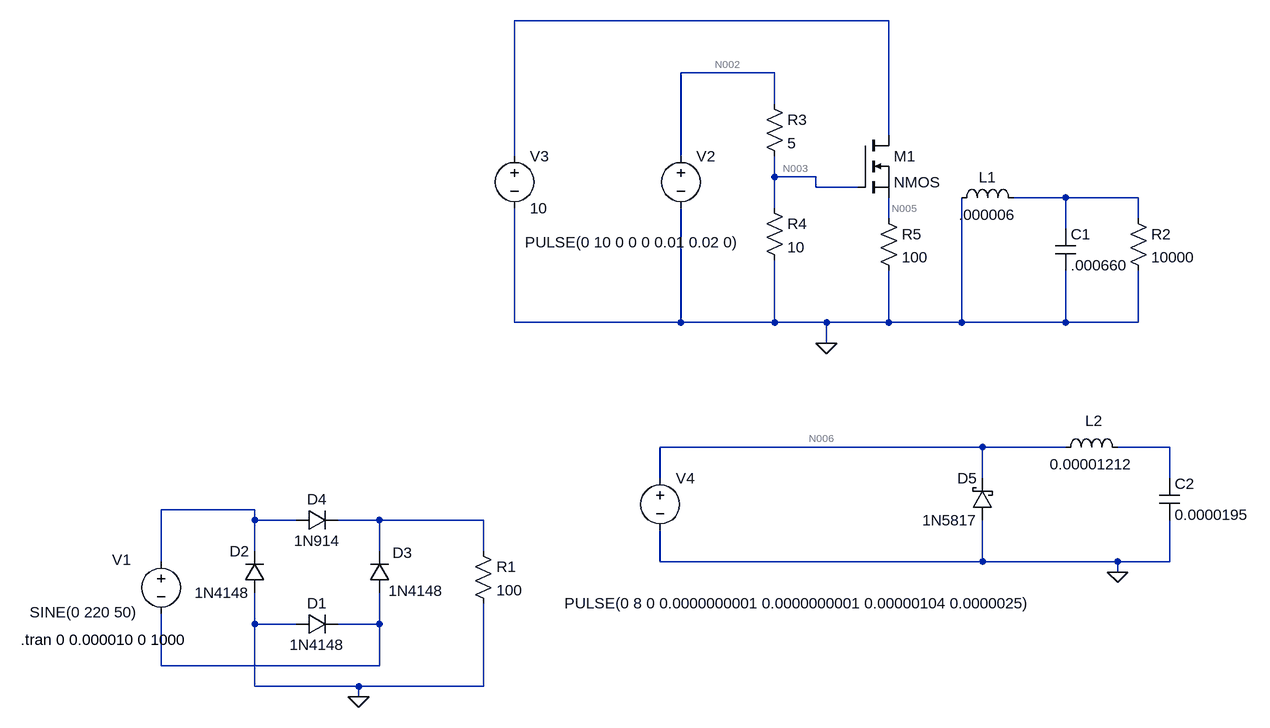
[diagram p0: schematic circuit_ver1.5.3_Ned_mohan.asc]
circuit_ver1.5.3_Ned_mohan.asc, the LTspice schematic file:
Version 4
SHEET 1 880 680
WIRE -128 -720 -704 -720
WIRE -304 -640 -448 -640
WIRE -304 -592 -304 -640
WIRE -128 -544 -128 -720
WIRE -704 -512 -704 -720
WIRE -448 -512 -448 -640
WIRE -304 -480 -304 -512
WIRE -240 -480 -304 -480
WIRE -240 -464 -240 -480
WIRE -176 -464 -240 -464
WIRE 144 -448 64 -448
WIRE 256 -448 144 -448
WIRE -304 -432 -304 -480
WIRE -128 -416 -128 -448
WIRE 256 -416 256 -448
WIRE 144 -400 144 -448
WIRE -704 -256 -704 -432
WIRE -448 -256 -448 -432
WIRE -448 -256 -704 -256
WIRE -304 -256 -304 -352
WIRE -304 -256 -448 -256
WIRE -224 -256 -304 -256
WIRE -128 -256 -128 -336
WIRE -128 -256 -224 -256
WIRE -16 -256 -16 -448
WIRE -16 -256 -128 -256
WIRE 144 -256 144 -336
WIRE 144 -256 -16 -256
WIRE 256 -256 256 -336
WIRE 256 -256 144 -256
WIRE -224 -224 -224 -256
WIRE 16 -64 -480 -64
WIRE 144 -64 16 -64
WIRE 304 -64 224 -64
WIRE -480 -16 -480 -64
WIRE 16 -16 16 -64
WIRE 304 -16 304 -64
WIRE -1104 32 -1248 32
WIRE -1104 48 -1104 32
WIRE -1040 48 -1104 48
WIRE -912 48 -976 48
WIRE -752 48 -912 48
WIRE -1104 96 -1104 48
WIRE -912 96 -912 48
WIRE -752 96 -752 48
WIRE -1248 112 -1248 32
WIRE -480 112 -480 64
WIRE 16 112 16 48
WIRE 16 112 -480 112
WIRE 224 112 16 112
WIRE 304 112 304 48
WIRE 304 112 224 112
WIRE 224 128 224 112
WIRE -1104 208 -1104 160
WIRE -1040 208 -1104 208
WIRE -912 208 -912 160
WIRE -912 208 -976 208
WIRE -1248 272 -1248 192
WIRE -912 272 -912 208
WIRE -912 272 -1248 272
WIRE -1104 304 -1104 208
WIRE -944 304 -1104 304
WIRE -752 304 -752 176
WIRE -752 304 -944 304
WIRE -944 320 -944 304
FLAG -944 320 0
FLAG -224 -224 0
FLAG 224 128 0
SYMBOL voltage -1248 96 R0
WINDOW 3 -202 94 Left 2
WINDOW 123 0 0 Left 2
WINDOW 39 0 0 Left 2
WINDOW 0 -75 13 Left 2
SYMATTR Value SINE(0 220 50)
SYMATTR InstName V1
SYMBOL diode -1040 224 R270
WINDOW 0 32 32 VTop 2
WINDOW 3 0 32 VBottom 2
SYMATTR InstName D1
SYMATTR Value 1N4148
SYMBOL diode -1088 160 R180
WINDOW 0 24 64 Left 2
WINDOW 3 24 0 Left 2
SYMATTR InstName D2
SYMATTR Value 1N4148
SYMBOL diode -896 160 R180
WINDOW 0 -35 62 Left 2
WINDOW 3 -83 3 Left 2
SYMATTR InstName D3
SYMATTR Value 1N4148
SYMBOL diode -1040 64 R270
WINDOW 0 32 32 VTop 2
WINDOW 3 0 32 VBottom 2
SYMATTR InstName D4
SYMATTR Value 1N914
SYMBOL res -768 80 R0
SYMATTR InstName R1
SYMATTR Value 100
SYMBOL voltage -448 -528 R0
WINDOW 3 91 149 Right 2
WINDOW 123 0 0 Left 2
WINDOW 39 0 0 Left 2
SYMATTR Value PULSE(0 10 0 0 0 0.01 0.02 0)
SYMATTR InstName V2
SYMBOL nmos -176 -544 R0
SYMATTR InstName M1
SYMBOL res 240 -432 R0
SYMATTR InstName R2
SYMATTR Value 10000
SYMBOL res -320 -608 R0
SYMATTR InstName R3
SYMATTR Value 5
SYMBOL res -320 -448 R0
SYMATTR InstName R4
SYMATTR Value 10
SYMBOL voltage -704 -528 R0
WINDOW 123 0 0 Left 2
WINDOW 39 0 0 Left 2
SYMATTR InstName V3
SYMATTR Value 10
SYMBOL ind -32 -432 R270
WINDOW 0 32 56 VTop 2
WINDOW 3 5 56 VBottom 2
SYMATTR InstName L1
SYMATTR Value .000006
SYMBOL cap 128 -400 R0
SYMATTR InstName C1
SYMATTR Value .000660
SYMATTR SpiceLine V=50
SYMBOL res -144 -432 R0
SYMATTR InstName R5
SYMATTR Value 100
SYMBOL ind 128 -48 R270
WINDOW 0 41 60 VTop 2
WINDOW 3 5 56 VBottom 2
SYMATTR InstName L2
SYMATTR Value 0.00001212
SYMBOL cap 288 -16 R0
SYMATTR InstName C2
SYMATTR Value 0.0000195
SYMBOL voltage -480 -32 R0
WINDOW 3 -147 208 Left 2
WINDOW 123 0 0 Left 2
WINDOW 39 0 0 Left 2
SYMATTR Value PULSE(0 8 0 0.0000000001 0.0000000001 0.00000104 0.0000025)
SYMATTR InstName V4
SYMBOL schottky 32 48 R180
WINDOW 0 24 64 Left 2
WINDOW 3 24 0 Left 2
SYMATTR InstName D5
SYMATTR Value 1N5817
SYMATTR Description Diode
SYMATTR Type diode
TEXT -1464 232 Left 2 !.tran 0 0.000010 0 1000

The netlist it stands for:
* circuit_ver1.5.3_Ned_mohan.asc
V1 N008 N010 SINE(0 220 50)
D1 0 N010 1N4148
D2 0 N008 1N4148
D3 N010 N009 1N4148
D4 N008 N009 1N914
R1 N009 0 100
V2 N002 0 PULSE(0 10 0 0 0 0.01 0.02 0)
M1 N001 N003 N005 N005 NMOS
R2 N004 0 10000
R3 N002 N003 5
R4 N003 0 10
V3 N001 0 10
L1 0 N004 .000006
C1 N004 0 .000660 V=50
R5 N005 0 100
L2 N006 N007 0.00001212
C2 N007 0 0.0000195
V4 N006 0 PULSE(0 8 0 0.0000000001 0.0000000001 0.00000104 0.0000025)
D5 0 N006 1N5817
.model D D
.lib standard.dio
.model NMOS NMOS
.model PMOS PMOS
.lib standard.mos
.tran 0 0.000010 0 1000
.backanno
.end

* Results of the author's LTspice run, read from the files saved beside the schematic
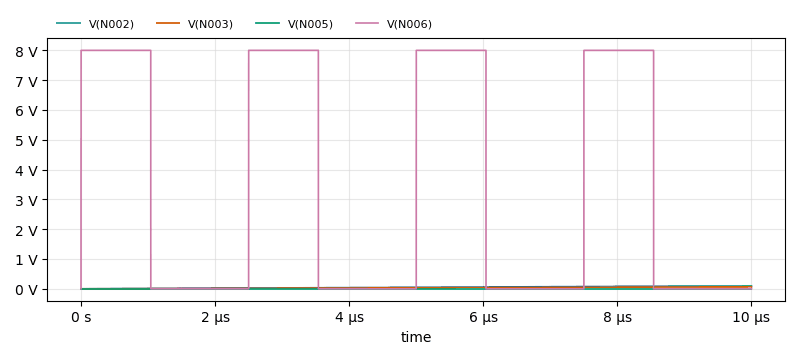
[diagram p1: Transient Analysis of circuit_ver1.5.3_Ned_mohan.asc, plotted from the saved traces]
* Transient Analysis, 1 run:
*   V(N002): min 0 V, max 100 mV, average 50 mV, rms 57.76 mV, last 100 mV
*   V(N003): min 0 V, max 66.67 mV, average 33.33 mV, rms 38.51 mV, last 66.67 mV
*   V(N005): min 2.001 nV, max 4.446 µV, average 1.485 µV, rms 1.991 µV, last 4.446 µV
*   V(N006): min 0 V, max 8 V, average 3.328 V, rms 5.16 V, last 0 V